# Altium schematic sheet LPCB235 - RS485 MUX CONTROL.SchDoc
size A3; Address1: Factory 10; Address2: 9-13 Dingley Avenue, Dandeong, VICTORIA 3175, AUSTRALIA; DocumentNumber: 8; Revision: 1; SheetNumber: 8; SheetTotal: 14; Lockie__PCB_SUB_ASSEMBLY: RS485 Mux.; Lockie__PCB_ASSEMBLY: Command Node; Lockie__LDL: LPCB218; Lockie__PCB_DESCRIPTION: Command Node
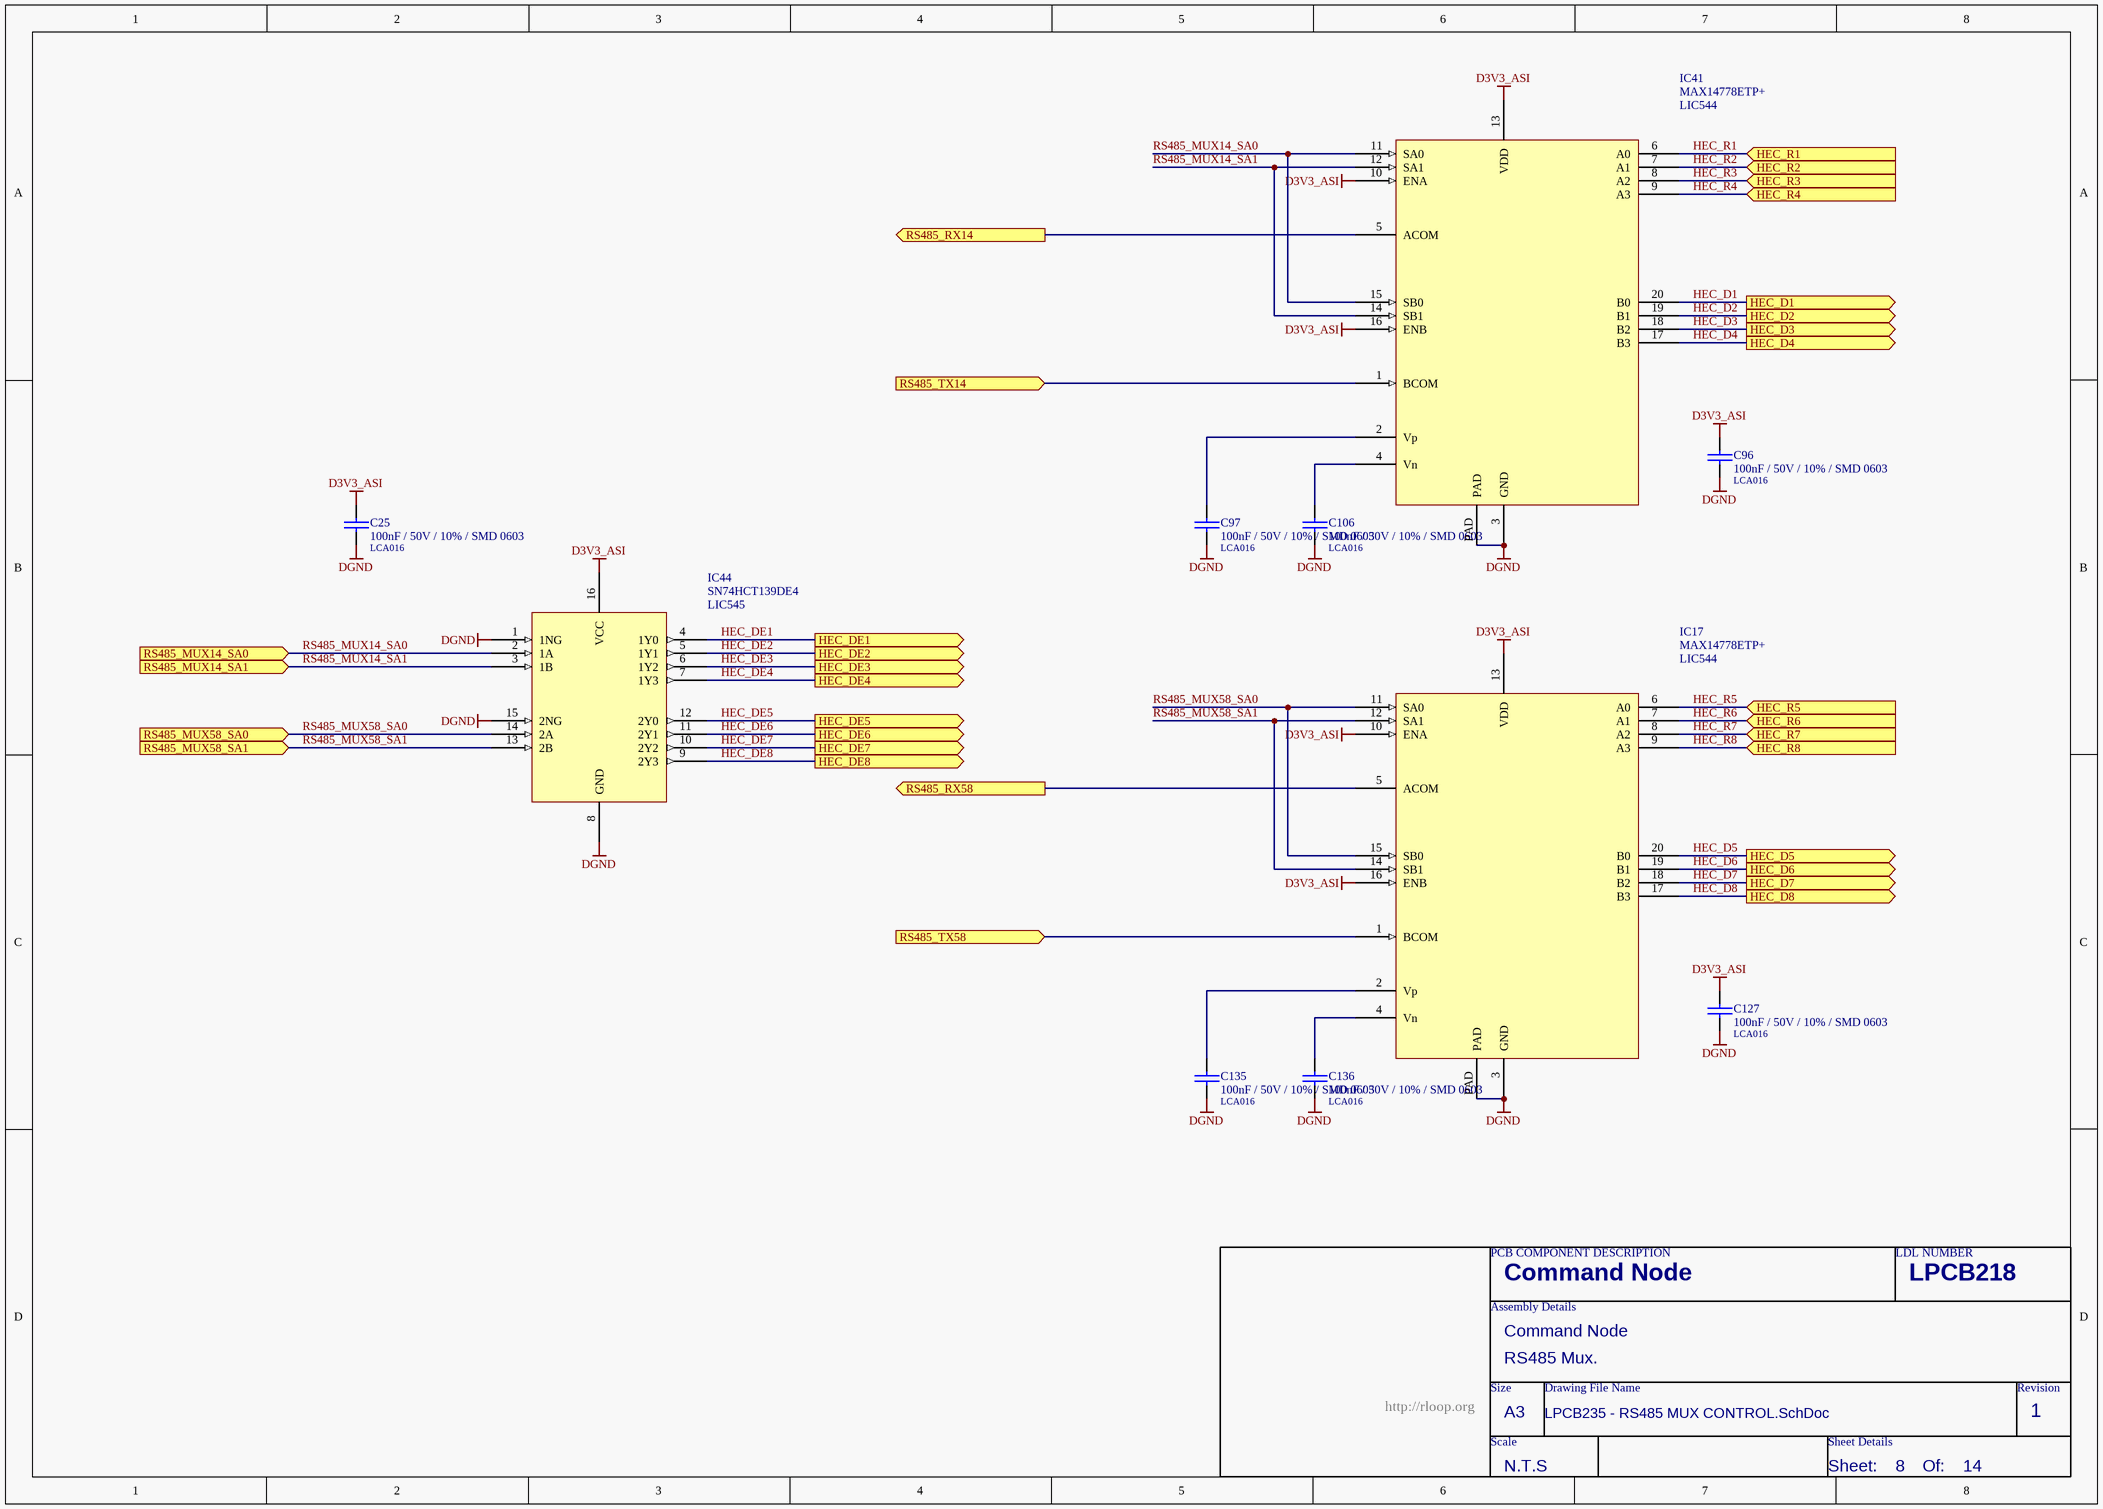
[diagram p0: LPCB235 - RS485 MUX CONTROL.SchDoc]

## Parts
C25  100nF / 50V / 10% / SMD 0603  LDL_NUMBER: LCA016  [LFP011__CC1608-0603-IPC7351_B]
C96  100nF / 50V / 10% / SMD 0603  LDL_NUMBER: LCA016  [LFP011__CC1608-0603-IPC7351_B]
C97  100nF / 50V / 10% / SMD 0603  LDL_NUMBER: LCA016  [LFP011__CC1608-0603-IPC7351_B]
C106  100nF / 50V / 10% / SMD 0603  LDL_NUMBER: LCA016  [LFP011__CC1608-0603-IPC7351_B]
C127  100nF / 50V / 10% / SMD 0603  LDL_NUMBER: LCA016  [LFP011__CC1608-0603-IPC7351_B]
C135  100nF / 50V / 10% / SMD 0603  LDL_NUMBER: LCA016  [LFP011__CC1608-0603-IPC7351_B]
C136  100nF / 50V / 10% / SMD 0603  LDL_NUMBER: LCA016  [LFP011__CC1608-0603-IPC7351_B]
IC17  MAX14778ETP+  LDL_NUMBER: LIC544  [LFP014__QFN65P500X500X80_HS-21N]
IC41  MAX14778ETP+  LDL_NUMBER: LIC544  [LFP014__QFN65P500X500X80_HS-21N]
IC44  SN74HCT139DE4  LDL_NUMBER: LIC545  [LFP079__SOP16]

## Ports
HEC_D1 (out), HEC_D2 (out), HEC_D3 (out), HEC_D4 (out), HEC_D5 (out), HEC_D6 (out), HEC_D7 (out), HEC_D8 (out), HEC_DE1 (out), HEC_DE2 (out), HEC_DE3 (out), HEC_DE4 (out), HEC_DE5 (out), HEC_DE6 (out), HEC_DE7 (out), HEC_DE8 (out), HEC_R1 (in), HEC_R2 (in), HEC_R3 (in), HEC_R4 (in), HEC_R5 (in), HEC_R6 (in), HEC_R7 (in), HEC_R8 (in), RS485_MUX14_SA0 (in), RS485_MUX14_SA1 (in), RS485_MUX58_SA0 (in), RS485_MUX58_SA1 (in), RS485_RX14 (out), RS485_RX58 (out), RS485_TX14 (in), RS485_TX58 (in)

## Nets
D3V3_ASI: C25.1 C96.1 C127.1 IC17.10(ENA) IC17.13(VDD) IC17.16(ENB) IC41.10(ENA) IC41.13(VDD) IC41.16(ENB) IC44.16(VCC)
DGND: C25.2 C96.2 C97.2 C106.2 C127.2 C135.2 C136.2 IC17.3(GND) IC17.PAD IC41.3(GND) IC41.PAD IC44.1(1NG) IC44.8(GND) IC44.15(2NG)
HEC_D1: IC41.20(B0) ; port HEC_D1
HEC_D2: IC41.19(B1) ; port HEC_D2
HEC_D3: IC41.18(B2) ; port HEC_D3
HEC_D4: IC41.17(B3) ; port HEC_D4
HEC_D5: IC17.20(B0) ; port HEC_D5
HEC_D6: IC17.19(B1) ; port HEC_D6
HEC_D7: IC17.18(B2) ; port HEC_D7
HEC_D8: IC17.17(B3) ; port HEC_D8
HEC_DE1: IC44.4(1Y0) ; port HEC_DE1
HEC_DE2: IC44.5(1Y1) ; port HEC_DE2
HEC_DE3: IC44.6(1Y2) ; port HEC_DE3
HEC_DE4: IC44.7(1Y3) ; port HEC_DE4
HEC_DE5: IC44.12(2Y0) ; port HEC_DE5
HEC_DE6: IC44.11(2Y1) ; port HEC_DE6
HEC_DE7: IC44.10(2Y2) ; port HEC_DE7
HEC_DE8: IC44.9(2Y3) ; port HEC_DE8
HEC_R1: IC41.6(A0) ; port HEC_R1
HEC_R2: IC41.7(A1) ; port HEC_R2
HEC_R3: IC41.8(A2) ; port HEC_R3
HEC_R4: IC41.9(A3) ; port HEC_R4
HEC_R5: IC17.6(A0) ; port HEC_R5
HEC_R6: IC17.7(A1) ; port HEC_R6
HEC_R7: IC17.8(A2) ; port HEC_R7
HEC_R8: IC17.9(A3) ; port HEC_R8
RS485_MUX14_SA0: IC41.11(SA0) IC41.15(SB0) IC44.2(1A) ; port RS485_MUX14_SA0
RS485_MUX14_SA1: IC41.12(SA1) IC41.14(SB1) IC44.3(1B) ; port RS485_MUX14_SA1
RS485_MUX58_SA0: IC17.11(SA0) IC17.15(SB0) IC44.14(2A) ; port RS485_MUX58_SA0
RS485_MUX58_SA1: IC17.12(SA1) IC17.14(SB1) IC44.13(2B) ; port RS485_MUX58_SA1
RS485_RX14: IC41.5(ACOM) ; port RS485_RX14
RS485_RX58: IC17.5(ACOM) ; port RS485_RX58
RS485_TX14: IC41.1(BCOM) ; port RS485_TX14
RS485_TX58: IC17.1(BCOM) ; port RS485_TX58
NetC97_1: C97.1 IC41.2(Vp)
NetC106_1: C106.1 IC41.4(Vn)
NetC135_1: C135.1 IC17.2(Vp)
NetC136_1: C136.1 IC17.4(Vn)

## Notes on the sheet
- PCB COMPONENT DESCRIPTION
- LDL NUMBER
- Assembly Details
- Size
- Drawing File Name
- Revision
- http://rloop.org
- Scale
- A3
- Sheet Details
- N.T.S
- Sheet:
- Of:

## Library data of the parts
C25 C96 C97 C106 C127 C135 C136 = 100nF / 50V / 10% / SMD 0603: Capacitor, Ceramic Chip, 100nF (0.1uF), 50V, 5%, SMD 0603 [LCA016]; Value: 100n; FMEDA__OPERATING__VOLTAGE_MIN: 0; FMEDA__OPERATING__VOLTAGE_MAX: 3.3; FMEDA__OPERATING__TEMP_MIN: -20; FMEDA__OPERATING__TEMP_TYP: 27; FMEDA__OPERATING__TEMP_MAX: 50; FMEDA__CHANNEL: COM; FMEDA__FUNCTION_IN_SYSTEM: *; FMEDA__OPERATING__VOLTAGE_TYP: 3.3
IC17 IC41 = MAX14778ETP+: IC, Mux 25V, SMD QFN20 [LIC544]
IC44 = SN74HCT139DE4: IC, Dual 2-4 Demux, SMD SOIC-16